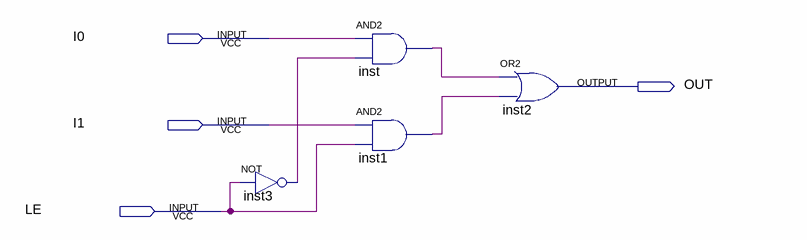
[diagram p0: schematic sheet]
// Quartus schematic MUX2.bdf as structural Verilog: 4 symbols, 4 pins
module MUX2 (
  input  I0,
  input  I1,
  input  LE,
  output OUT
);

  wire inst1_out, inst3_out, inst_out;

  not inst3 (inst3_out, LE);
  and inst (inst_out, I0, inst3_out);
  and inst1 (inst1_out, I1, LE);
  or inst2 (OUT, inst_out, inst1_out);
endmodule
